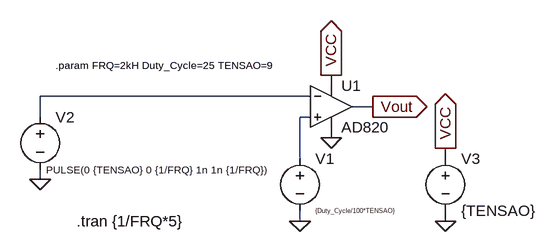
[diagram p0: schematic PWM with OpAmp.asc]
PWM with OpAmp.asc, the LTspice schematic file:
Version 4
SHEET 1 1768 680
WIRE 1216 -160 1216 -176
WIRE 1184 -144 768 -144
WIRE 1280 -128 1248 -128
WIRE 768 -112 768 -144
WIRE 1184 -112 1168 -112
WIRE 1216 -80 1216 -96
WIRE 1168 -48 1168 -112
WIRE 1392 -48 1392 -64
WIRE 768 -16 768 -32
WIRE 1168 48 1168 32
WIRE 1392 48 1392 32
FLAG 1168 48 0
FLAG 768 -16 0
FLAG 1392 48 0
FLAG 1392 -64 VCC
IOPIN 1392 -64 Out
FLAG 1216 -176 VCC
IOPIN 1216 -176 Out
FLAG 1280 -128 Vout
IOPIN 1280 -128 Out
FLAG 1216 -80 0
SYMBOL voltage 1168 -64 R0
WINDOW 123 0 0 Left 0
WINDOW 39 0 0 Left 0
WINDOW 3 24 96 Left 0
SYMATTR Value {Duty_Cycle/100*TENSAO}
SYMATTR InstName V1
SYMBOL voltage 768 -128 R0
WINDOW 3 9 97 Left 1
WINDOW 123 0 0 Left 0
WINDOW 39 0 0 Left 0
SYMATTR Value PULSE(0 {TENSAO} 0 {1/FRQ} 1n 1n {1/FRQ})
SYMATTR InstName V2
SYMBOL voltage 1392 -64 R0
SYMATTR InstName V3
SYMATTR Value {TENSAO}
SYMBOL OpAmps\\AD820 1216 -192 R0
SYMATTR InstName U1
TEXT 824 48 Left 2 !.tran {1/FRQ*5}
TEXT 792 -192 Left 1 !.param FRQ=2kH Duty_Cycle=25 TENSAO=9

The netlist it stands for:
* PWM with OpAmp.asc
V1 N002 0 {Duty_Cycle/100*TENSAO}
V2 N001 0 PULSE(0 {TENSAO} 0 {1/FRQ} 1n 1n {1/FRQ})
V3 VCC 0 {TENSAO}
XU1 N002 N001 VCC 0 Vout AD820  ; pins In+ In- V+ V- OUT
.tran {1/FRQ*5}
.param FRQ=2kH Duty_Cycle=25 TENSAO=9
.backanno
.end